# Altium schematic sheet Sheet1.SchDoc
size A4
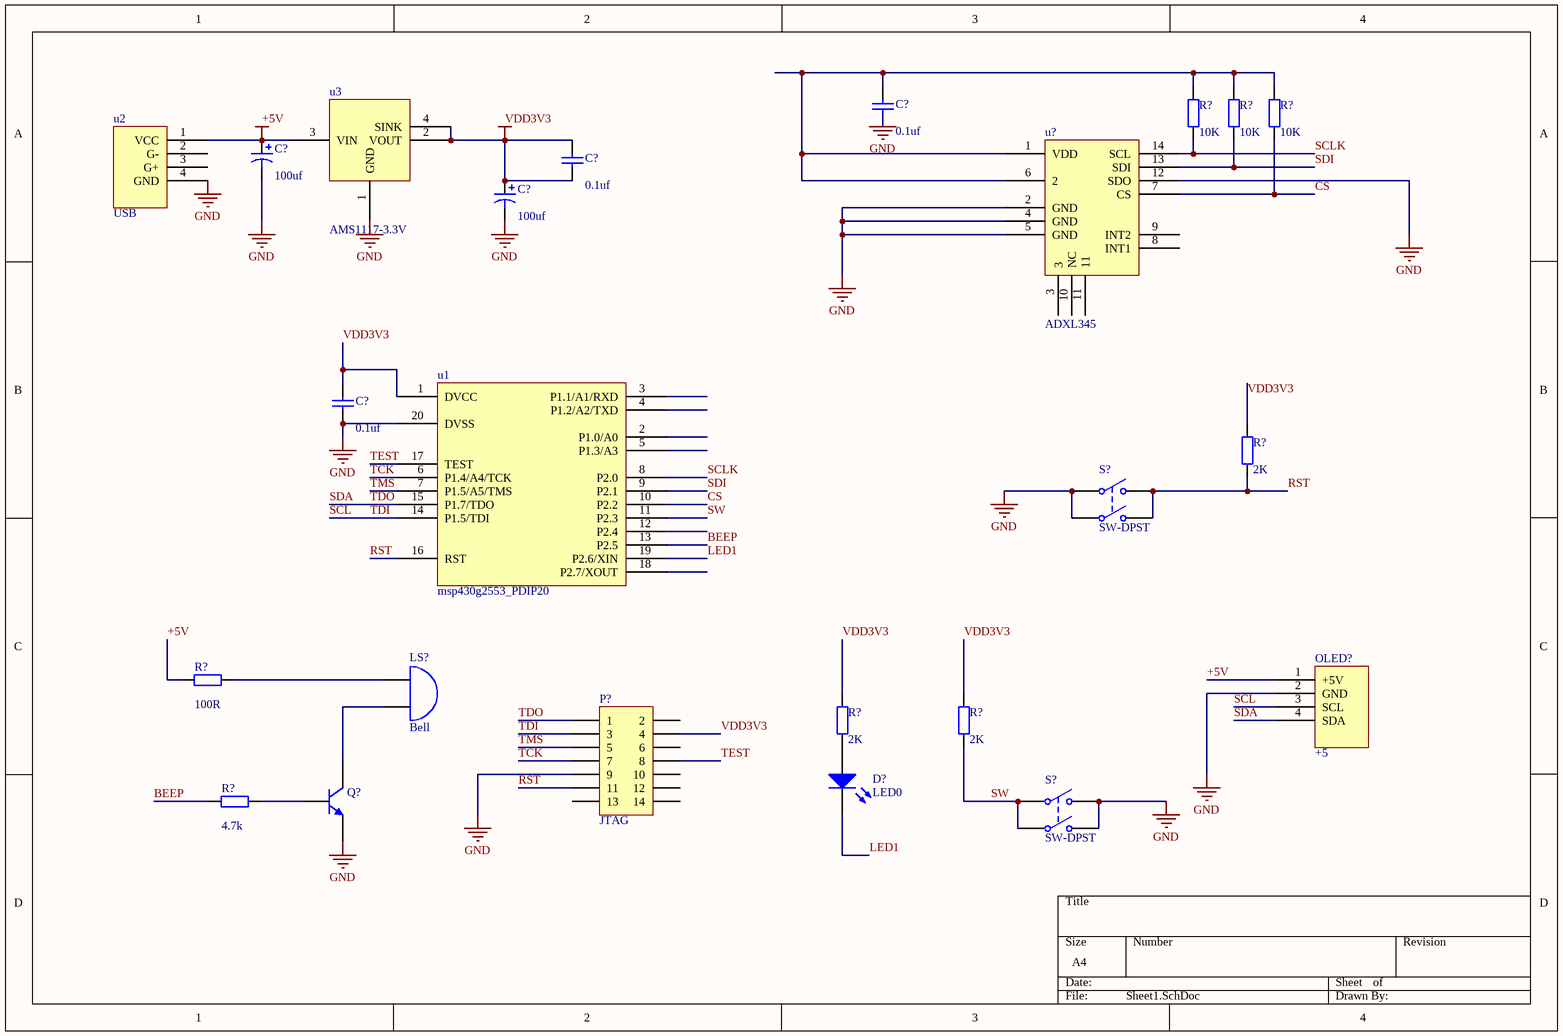
[diagram p0: Sheet1.SchDoc]

## Parts
(Parts that share a designator on the sheet are numbered #1, #2 ... from top to bottom, then left to right.)
C?#1  value 0.1uf  [6-0805_N]  (hidden comment: Cap)
C?#2  value 100uf  [Cap2_polar]  (hidden comment: Cap Pol2)
C?#3  value 0.1uf  [6-0805_N]  (hidden comment: Cap)
C?#4  value 100uf  [Cap2_polar]  (hidden comment: Cap Pol2)
C?#5  value 0.1uf  [6-0805_N]  (hidden comment: Cap)
D?  LED0  [6-0805_N - duplicate]
LS?  Bell  [bell]
OLED?  +5  [OLED]
P?  JTAG  [HDR2X7]
Q?  NPN  [SOT23_N]  (value not drawn)
R?#1  value 10K  [6-0805_N]  (hidden comment: Res2)
R?#2  value 10K  [6-0805_N]  (hidden comment: Res2)
R?#3  value 10K  [6-0805_N]  (hidden comment: Res2)
R?#4  value 2K  [6-0805_N]  (hidden comment: Res2)
R?#5  value 100R  [6-0805_N]  (hidden comment: Res2)
R?#6  value 2K  [6-0805_N]  (hidden comment: Res2)
R?#7  value 2K  [6-0805_N]  (hidden comment: Res2)
R?#8  value 4.7k  [6-0805_N]  (hidden comment: Res2)
S?#1  SW-DPST  [DPST-4]
S?#2  SW-DPST  [DPST-4]
u1  msp430g2553_PDIP20  [DIP20]
u2  USB  [USB2.5-2H4]
u3  AMS1117-3.3V  [SOT223_N]
u?  ADXL345  [ADXL345]

## Nets
3.3: C?#3.1 C?#3.2 C?#4.2 u3.2(VOUT) u3.4(SINK)
+5: C?#2.2 u2.1(VCC) u3.3(VIN)
GND: C?#1.1 C?#2.1 C?#4.1 C?#5.1 OLED?.2(GND) P?.9 Q?.3(E) S?#1.1(COMMON1) S?#1.2(COMMON2) S?#2.3(NO1) S?#2.4(NO2) u1.20(DVSS) u2.4(GND) u3.1(GND) u?.2(GND) u?.4(GND) u?.5(GND) u?.12(SDO)
+5V: OLED?.1(+5V) R?#5.1
BEEP: R?#8.1 u1.13(P2.5)
CS: R?#3.1 u1.10(P2.2) u?.7(CS)
LED1: D?.2(K) u1.19(P2.6/XIN)
RST: P?.11 R?#4.1 S?#1.3(NO1) S?#1.4(NO2) u1.16(RST)
SCL: OLED?.3(SCL) P?.3 u1.14(P1.5/TDI)  [also labelled TDI]
SCLK: R?#1.1 u1.8(P2.0) u?.14(SCL)
SDA: OLED?.4(SDA) P?.1 u1.15(P1.7/TDO)  [also labelled TDO]
SDI: R?#2.1 u1.9(P2.1) u?.13(SDI)
SW: R?#7.1 S?#2.1(COMMON1) S?#2.2(COMMON2) u1.11(P2.3)
TCK: P?.7 u1.6(P1.4/A4/TCK)
TEST: P?.8 u1.17(TEST)
TMS: P?.5 u1.7(P1.5/A5/TMS)
VDD3V3: C?#5.2 P?.4 R?#4.2 R?#6.2 R?#7.2 u1.1(DVCC)
NetC?#1_2: C?#1.2 R?#1.2 R?#2.2 R?#3.2 u?.1(VDD) u?.6(2)
NetD?_1: D?.1(A) R?#6.1
NetLS?_1: LS?.1(A) R?#5.2
NetLS?_2: LS?.2(B) Q?.1(C)
NetQ?_2: Q?.2(B) R?#8.2

Not connected (* = marked no-connect by the designer): P? 2 6 10 12 13 14; u1 2(P1.0/A0) 3(P1.1/A1/RXD) 4(P1.2/A2/TXD) 5(P1.3/A3) 12(P2.4) 18(P2.7/XOUT); u2 2(G-) 3(G+); u? 3 8(INT1) 9(INT2) 10(NC) 11

## Notes on the sheet
- Labels drawn without touching a wire or pin: +5V, VDD3V3

## Library data of the parts
C?#1 C?#3 C?#5 = Cap: Capacitor; Published: 8-Jun-2000; LatestRevisionDate: 17-Jul-2002; LatestRevisionNote: Re-released for DXP Platform.; PackageReference: RAD-0.3; Publisher: Altium Limited; PackageDescription: Radial Cap, Thru-Hole; 2 Leads; 0.3 in Pin Spacing
C?#2 C?#4 = Cap Pol2: Polarized Capacitor (Axial); Published: 8-Jun-2000; LatestRevisionDate: 17-Jul-2002; LatestRevisionNote: Re-released for DXP Platform.; PackageReference: POLAR0.8; Publisher: Altium Limited; PackageDescription: Polarized Capacitor; 2 Leads
D? = LED0: Typical INFRARED GaAs LED; Published: 8-Jun-2000; LatestRevisionDate: 08-Jul-2005; LatestRevisionNote: Mech Layer 1 removed.; PackageReference: LED-0; Publisher: Altium Limited; PackageDescription: LED; 2 Leads
LS? = Bell: Electrical Bell; Published: 24-Mar-1999; LatestRevisionDate: 17-Jul-2002; LatestRevisionNote: Re-released for DXP Platform.; PackageReference: PIN2; Publisher: Altium Limited
OLED? = OLED
P? = JTAG: Header, 7-Pin, Dual row; LatestRevisionDate: 17-Jul-2002; LatestRevisionNote: Re-released for DXP Platform.; Publisher: Altium Limited
Q? = NPN: NPN Bipolar Transistor; Published: 8-Jun-2000; LatestRevisionDate: 17-Jul-2002; LatestRevisionNote: Re-released for DXP Platform.; PackageReference: TO-226-AA; Publisher: Altium Limited; PackageDescription: TO, Flat Index; 3 In-Line, Axial Leads; Body Dia. 4.8mm; Leads 0.55 x 0.51 mm (max); Code_JEDEC: TO-226-AA
R?#1-R?#8 = Res2: Resistor; Published: 8-Jun-2000; LatestRevisionDate: 17-Jul-2002; LatestRevisionNote: Re-released for DXP Platform.; PackageReference: AXIAL-0.4; Publisher: Altium Limited; PackageDescription: Axial Device, Thru-Hole; 2 Leads; 0.4 in Pin Spacing
S?#1 S?#2 = SW-DPST: Double-Pole, Single-Throw Switch; Published: 24-Mar-1999; LatestRevisionDate: 17-Jul-2002; LatestRevisionNote: Re-released for DXP Platform.; PackageReference: DPST-4; Publisher: Altium Limited; PackageDescription: Switch; 4 Leads